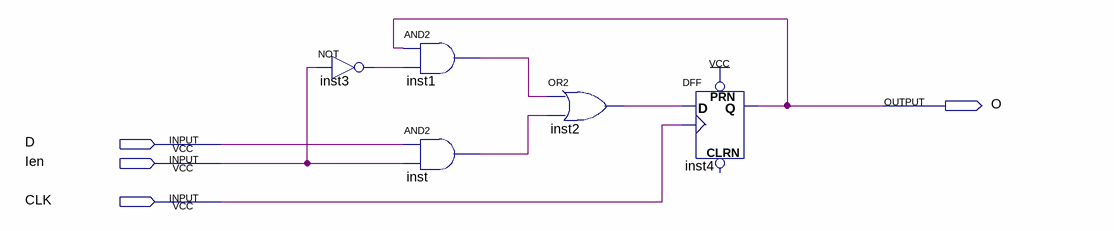
[diagram p0: schematic sheet]
// Quartus schematic reg_1bit.bdf as structural Verilog: 5 symbols, 4 pins
module reg_1bit (
  input  D,
  input  Ien,
  input  CLK,
  output O
);

  wire inst1_out, inst2_out, inst3_out, inst_out;

  not inst3 (inst3_out, Ien);
  and inst1 (inst1_out, O, inst3_out);
  and inst (inst_out, D, Ien);
  or inst2 (inst2_out, inst1_out, inst_out);
  DFF inst4 (.CLK(CLK), .D(inst2_out), .PRN(1'b1), .Q(O));  // open: CLRN
endmodule
